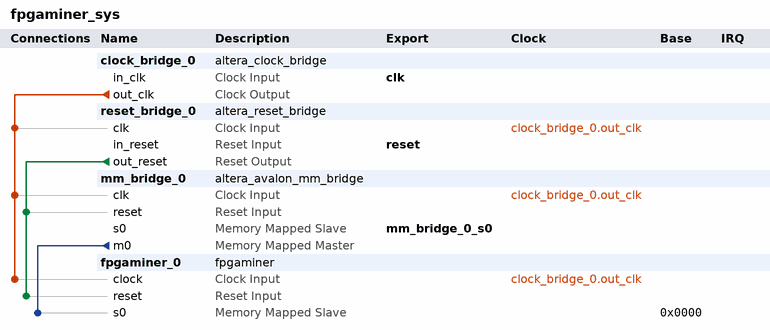
[diagram p0: system contents]
# Platform Designer (Qsys) system fpgaminer_sys
# Parameters at their usual value, and those the tool derives, are not listed.
package require -exact qsys 11.0
create_system fpgaminer_sys
set_project_property DEVICE_FAMILY STINGRAY

add_instance clock_bridge_0 altera_clock_bridge 11.0
set_instance_parameter_value clock_bridge_0 DERIVED_CLOCK_RATE 0
set_instance_parameter_value clock_bridge_0 EXPLICIT_CLOCK_RATE 0

add_instance reset_bridge_0 altera_reset_bridge 11.0
set_instance_parameter_value reset_bridge_0 ACTIVE_LOW_RESET 0
set_instance_parameter_value reset_bridge_0 SYNCHRONOUS_EDGES deassert

add_instance mm_bridge_0 altera_avalon_mm_bridge 11.0
set_instance_parameter_value mm_bridge_0 DATA_WIDTH 32
set_instance_parameter_value mm_bridge_0 ADDRESS_WIDTH 7
set_instance_parameter_value mm_bridge_0 ADDRESS_UNITS SYMBOLS
set_instance_parameter_value mm_bridge_0 MAX_PENDING_RESPONSES 1
set_instance_parameter_value mm_bridge_0 PIPELINE_COMMAND 0
set_instance_parameter_value mm_bridge_0 PIPELINE_RESPONSE 0

add_instance fpgaminer_0 fpgaminer 1.0

# connections
add_connection clock_bridge_0.out_clk fpgaminer_0.clock clock
add_connection clock_bridge_0.out_clk mm_bridge_0.clk clock
add_connection clock_bridge_0.out_clk reset_bridge_0.clk clock
add_connection reset_bridge_0.out_reset fpgaminer_0.reset reset
add_connection reset_bridge_0.out_reset mm_bridge_0.reset reset
add_connection mm_bridge_0.m0 fpgaminer_0.s0 avalon
set_connection_parameter_value mm_bridge_0.m0/fpgaminer_0.s0 baseAddress 0x0000

# exported interfaces
add_interface clk clock sink
set_interface_property clk EXPORT_OF clock_bridge_0.in_clk
add_interface reset reset sink
set_interface_property reset EXPORT_OF reset_bridge_0.in_reset
add_interface mm_bridge_0_s0 avalon slave
set_interface_property mm_bridge_0_s0 EXPORT_OF mm_bridge_0.s0

save_system fpgaminer_sys.qsys
